# EAGLE schematic Arduino_Shield_footprint (EAGLE 9.6.2)
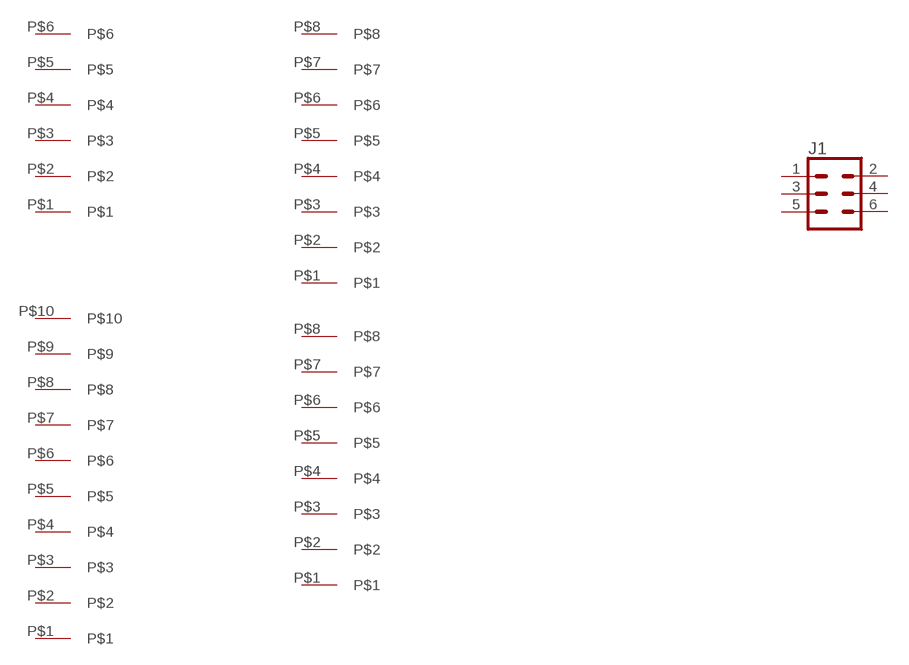
[diagram p0: schematic, sheet 1]

## Parts
H1  1_X_6_HEADER_GENERIC_.1INCH  [HEADER_1_X_6_.1_INCH]
H2  1_X_8_HEADER_GENERIC_.1INCH  [HEADER_1_X_8_.1_INCH]
H3  1_X_8_HEADER_GENERIC_.1INCH  [HEADER_1_X_8_.1_INCH]
J1  CONN_03X2  [2X3]
U$1  1_X_10_HEADER_GENERIC_.1INCH  [HEADER_1_X_10_.1_INCH]
Unconnected: H1.P$1 H1.P$2 H1.P$3 H1.P$4 H1.P$5 H1.P$6 H2.P$1 H2.P$2 H2.P$3 H2.P$4 H2.P$5 H2.P$6 H2.P$7 H2.P$8 H3.P$1 H3.P$2 H3.P$3 H3.P$4 H3.P$5 H3.P$6 H3.P$7 H3.P$8 J1.1 J1.2 J1.3 J1.4 J1.5 J1.6 U$1.P$1 U$1.P$2 U$1.P$3 U$1.P$4 U$1.P$5 U$1.P$6 U$1.P$7 U$1.P$8 U$1.P$9 U$1.P$10

## Library data of the parts
H1 = 3D_MIG_Controller:1_X_6_HEADER_GENERIC_.1INCH
H2 H3 = 3D_MIG_Controller:1_X_8_HEADER_GENERIC_.1INCH
J1 = 3D_MIG_Controller:CONN_03X2: Multi connection point. Often used as Generic Header-pin footprint for 0.1 inch spaced/style header connections For AVR SPI programming port, see special device with nice symbol: "AVR_SPI_PROG_5x2.dev" You can populate with any combo of single row headers, but if you'd like an exact match, check these: 2x5 AVR ICSP Male Header <https://www.sparkfun.com/products/778> (PRT-00778) 2x5 Pin Shrouded Header <https://www.sparkfun.com/products/8506> (PRT-08506) On any of the 0.1 inch spaced packages, you can populate with these: Break Away Headers - Straight <https://www.sparkfun.com/products/116> (PRT-00116) Break Away Male Headers - Right Angle <https://www.sparkfun.com/products/553> (PRT-00553) Female Headers <https://www.sparkfun.com/products/115> (PRT-00115) Break Away Headers - Machine Pin <https://www.sparkfun.com/products/117> (PRT-00117) Break Away Female Headers - Swiss Machine Pin <https://www.sparkfun.com/products/743> (PRT-00743) Special note: the shrouded connector mates well with our 5x2 ribbon cables: 2x5 Pin IDC Ribbon Cable <https://www.sparkfun.com/products/8535> (PRT-08535)
U$1 = 3D_MIG_Controller:1_X_10_HEADER_GENERIC_.1INCH